# Altium schematic sheet Management of Charging,Discharging,Tri-axis angle sensor.SchDoc
size A4
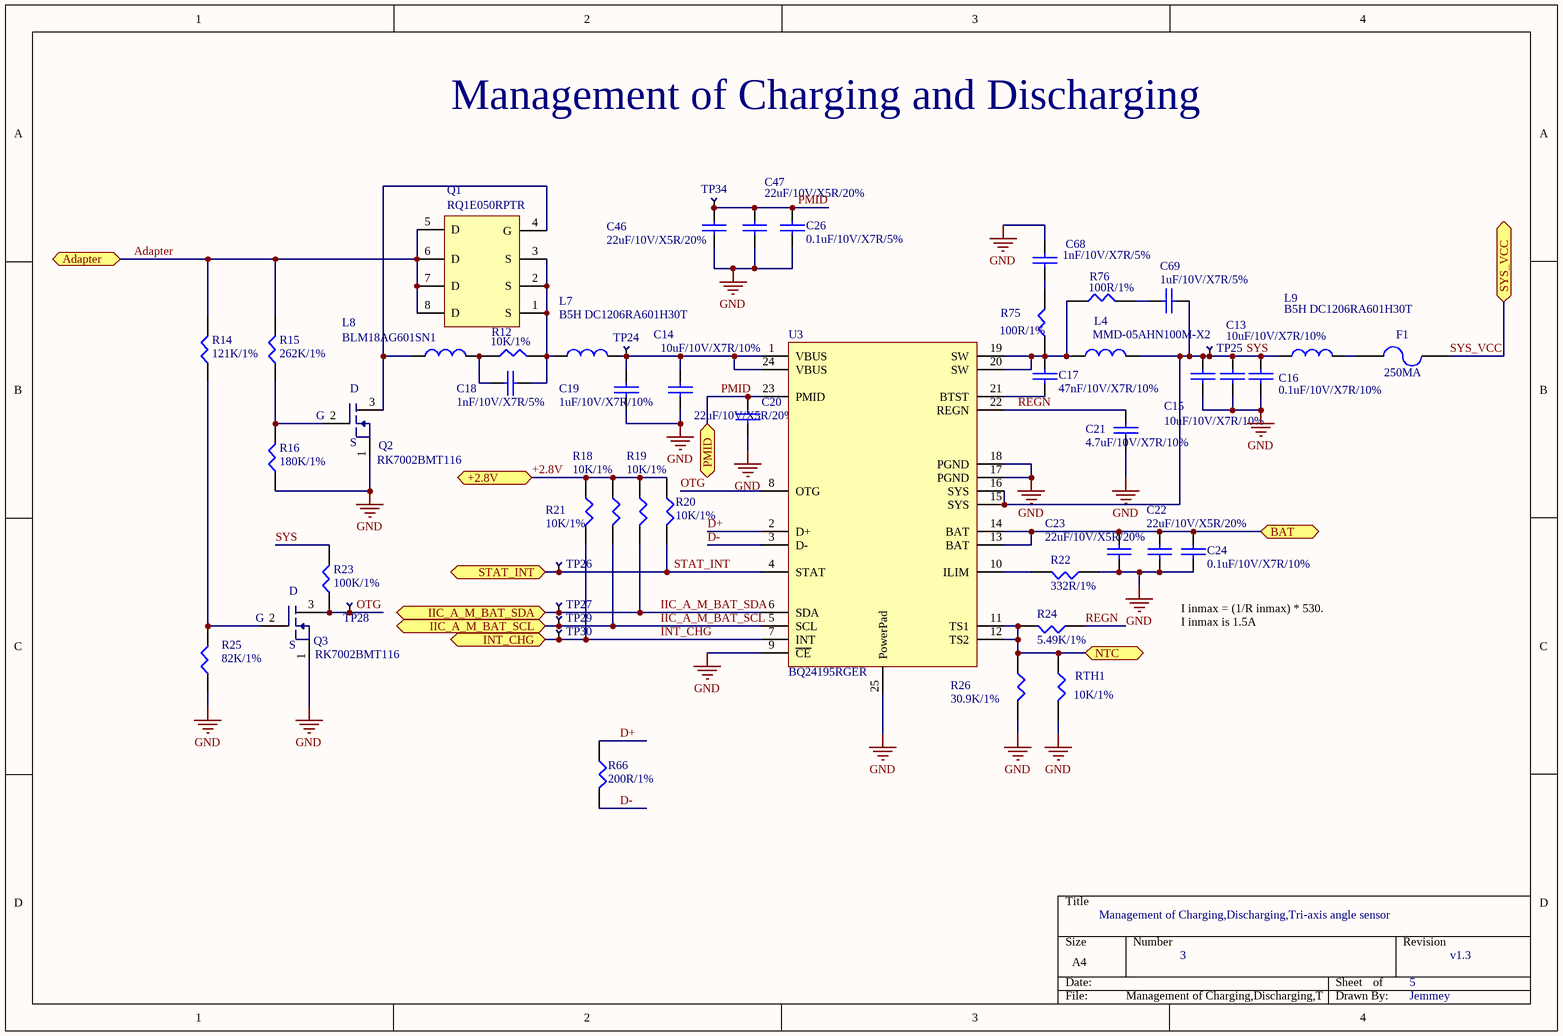
[diagram p0: Management of Charging,Discharging,Tri-axis angle sensor.SchDoc]

## Parts
C13  10uF/10V/X7R/10%  [0603C]
C14  10uF/10V/X7R/10%  [0603C]
C15  10uF/10V/X7R/10%  [0603C]
C16  0.1uF/10V/X7R/10%  [0402C]
C17  47nF/10V/X7R/10%  [0402C]
C18  1nF/10V/X7R/5%  [0402C]
C19  1uF/10V/X7R/10%  [0402C]
C20  22uF/10V/X5R/20%  [0603C]
C21  4.7uF/10V/X7R/10%  [0603C]
C22  22uF/10V/X5R/20%  [0603C]
C23  22uF/10V/X5R/20%  [0603C]
C24  0.1uF/10V/X7R/10%  [0402C]
C26  0.1uF/10V/X7R/5%  [0402C]
C46  22uF/10V/X5R/20%  [0603C]
C47  22uF/10V/X5R/20%  [0603C]
C68  1nF/10V/X7R/5%  [0603C]
C69  1uF/10V/X7R/5%  [0603C]
F1  250MA  [1206-FUSE]
L4  MMD-05AHN100M-X2  [MMD]
L7  B5H DC1206RA601H30T  [1206]
L8  BLM18AG601SN1  [0603R]
L9  B5H DC1206RA601H30T  [1206]
Q1  RQ1E050RPTR  [TSMT8]
Q2  RK7002BMT116  [SOT23]
Q3  RK7002BMT116  [SOT23]
R12  10K/1%  [0402R]
R14  121K/1%  [0402R]
R15  262K/1%  [0402R]
R16  180K/1%  [0402R]
R18  10K/1%  [0402R]
R19  10K/1%  [0402R]
R20  10K/1%  [0402R]
R21  10K/1%  [0402R]
R22  332R/1%  [0402R]
R23  100K/1%  [0402R]
R24  5.49K/1%  [0402R]
R25  82K/1%  [0402R]
R26  30.9K/1%  [0402R]
R66  200R/1%  [0402R]
R75  100R/1%  [0603R]
R76  100R/1%  [0603R]
RTH1  10K/1%  [0402R]
TP24  TEST  [Test Pad]  (value not drawn)
TP25  TEST  [Test Pad]  (value not drawn)
TP26  TEST  [Test Pad]  (value not drawn)
TP27  TEST  [Test Pad]  (value not drawn)
TP28  TEST  [Test Pad]  (value not drawn)
TP29  TEST  [Test Pad]  (value not drawn)
TP30  TEST  [Test Pad]  (value not drawn)
TP34  TEST  [Test Pad]  (value not drawn)
U3  BQ24195RGER  [RGE]

## Ports
+2.8V (bidir), Adapter (bidir), BAT, IIC_A_M_BAT_SCL, IIC_A_M_BAT_SDA, INT_CHG, NTC, PMID (bidir), STAT_INT (bidir), SYS_VCC (bidir)

## Nets
GND: C13.2 C14.2 C15.2 C16.2 C19.2 C20.2 C21.2 C22.2 C23.2 C24.2 C26.1 C46.2 C47.2 C68.2 Q2.1(S) Q3.1(S) R16.1 R22.1 R25.1 R26.2 RTH1.2 U3.9(~{CE}) U3.17(PGND) U3.18(PGND) U3.25(PowerPad)
+2.8V: R18.1 R19.1 R20.1 R21.1 ; port +2.8V
Adapter: Q1.5(D) Q1.6(D) Q1.7(D) Q1.8(D) R14.2 R15.2 ; port Adapter
BAT: C22.1 C23.1 C24.1 U3.13(BAT) U3.14(BAT) ; port BAT
D+: R66.1 U3.2(D+)
D-: R66.2 U3.3(D-)
IIC_A_M_BAT_SCL: R18.2 TP29.1 U3.5(SCL) ; port IIC_A_M_BAT_SCL
IIC_A_M_BAT_SDA: R19.2 TP27.1 U3.6(SDA) ; port IIC_A_M_BAT_SDA
INT_CHG: R21.2 TP30.1 U3.7(INT) ; port INT_CHG
NTC: R24.2 R26.1 RTH1.1 U3.11(TS1) U3.12(TS2) ; port NTC
OTG: Q3.3(D) R23.1 TP28.1 U3.8(OTG)
PMID: C20.1 C26.2 C46.1 C47.1 TP34.1 U3.23(PMID) ; port PMID
REGN: C21.1 R24.1 U3.22(REGN)
STAT_INT: R20.2 TP26.1 U3.4(STAT) ; port STAT_INT
SYS: C13.1 C15.1 C16.1 C69.1 L4.2 L9.1 R23.2 TP25.1 U3.15(SYS) U3.16(SYS)
SYS_VCC: F1.1 ; port SYS_VCC
NetC14_1: C14.1 C19.1 L7.2 TP24.1 U3.1(VBUS) U3.24(VBUS)
NetC17_1: C17.1 L4.1 R75.1 R76.1 U3.19(SW) U3.20(SW)
NetC17_2: C17.2 U3.21(BTST)
NetC18_1: C18.1 L8.2 R12.1
NetC18_2: C18.2 L7.1 Q1.1(S) Q1.2(S) Q1.3(S) R12.2
NetC68_1: C68.1 R75.2
NetC69_2: C69.2 R76.2
NetF1_2: F1.2 L9.2
NetL8_1: L8.1 Q1.4(G) Q2.3(D)
NetQ2_2: Q2.2(G) R15.1 R16.2
NetQ3_2: Q3.2(G) R14.1 R25.2
NetR22_2: R22.2 U3.10(ILIM)

## Notes on the sheet
- Management of Charging and Discharging
- I inmax = (1/R inmax) * 530.
  I inmax is 1.5A
- Management of Charging,Discharging,Tri-axis angle sensor
- 3
- 5
- v1.3
- Jemmey

## Library data of the parts
C13-C15 = CAP: 厂家：Murata，型号：GRM188R61A106KE69D
C16 C24 = CAP: 厂家：Murata，型号：GRM155R71A104KA01D
C17 = CAP: 厂家：Murata，型号：GRM155R71H473KE14D
C18 C26 C69 = CAP: 厂家：Murata，型号：GRM1555C1H102JA01D
C19 = CAP: 厂家：Murata，型号：GRM155R61C105KA12D
C20 C22 C23 C46 C47 = CAP: 厂家：Murata，型号：GRM188R61A226ME15D
C21 = CAP: 厂家：Murata，型号：GRM188R61A475KE15D
C68 = CAP: 厂家：Murata，型号：
F1 = FUSE2: 厂家：万瑞和，型号：WH1206-050
L4 = CHOKE: 厂家：Mag，型号：MMD-05AHN100M-X2
L7 L9 = CHOKE: 厂家：宇磁，型号：B5H DC1206RA601H30T
L8 = CHOKE: 厂家：MURATA，型号：BLM18AG601SN1
Q1 = RQ1: 厂家：ROHM，型号：   RQ1E050RPTR
Q2 Q3 = RK7002BMT116: 厂家：Vishay，型号：RK7002BMT116
R12 R18-R21 R75 R76 RTH1 = RES1: 厂家：Yageo，型号：RC0402FR-0710KL
R14 = RES1: 厂家：Yageo，型号：RC0402FR-07121KL
R15 = RES1: 厂家：Yageo，型号：RC0402FR-07262KL
R16 = RES1: 厂家：Yageo，型号：RC0402FR-07180KL
R22 = RES1: 厂家：Yageo，型号：RC0402FR-07332RL
R23 = RES1: 厂家：Yageo，型号：RC0402FR-07100KL
R24 = RES1: 厂家：Yageo，型号：RC0402FR-075K49L
R25 = RES1: 厂家：Yageo，型号：RC0402FR-0782KL
R26 = RES1: 厂家：Yageo，型号：RC0402FR-0730K9L
R66 = RES1: 厂家：Yageo，型号：RC0402FR-07200RL
TP24-TP30 TP34 = TEST: Test Point
U3 = BQ: 厂家：TI，型号：BQ24195RGER